# Altium schematic sheet 电源模块.schdoc: AT long bus (13.3 x 4.2 inches)
size A4; Organization: Organization; Address1: Address1; Address2: Address2; Address3: Address3; Address4: Address4; DocumentNumber: 1; Revision: 0; SheetNumber: 2; SheetTotal: 2
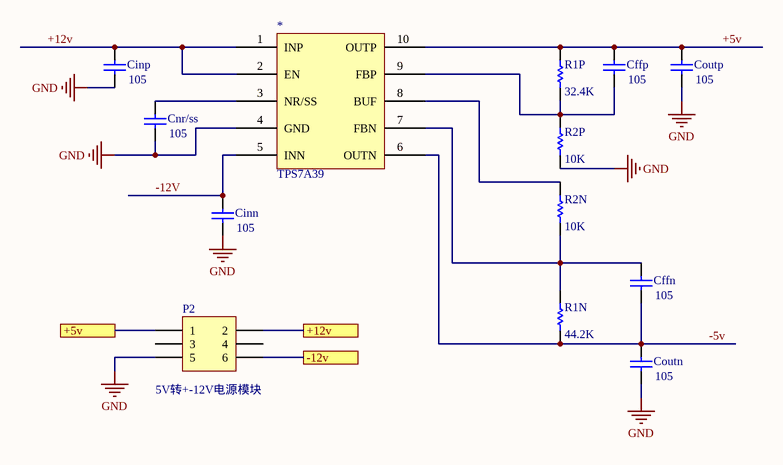
[diagram p0: 电源模块.schdoc]

## Parts
*  TPS7A39
Cffn  value 105  [RAD-0.3]  (hidden comment: Cap)
Cffp  value 105  [RAD-0.3]  (hidden comment: Cap)
Cinn  value 105  [RAD-0.3]  (hidden comment: Cap)
Cinp  value 105  [RAD-0.3]  (hidden comment: Cap)
Cnr/ss  value 105  [RAD-0.3]  (hidden comment: Cap)
Coutn  value 105  [RAD-0.3]  (hidden comment: Cap)
Coutp  value 105  [RAD-0.3]  (hidden comment: Cap)
P2  5V转+-12V电源模块  [HDR2X3]
R1N  value 44.2K  [AXIAL-0.3]  (hidden comment: Res1)
R1P  value 32.4K  [AXIAL-0.3]  (hidden comment: Res1)
R2N  value 10K  [AXIAL-0.3]  (hidden comment: Res1)
R2P  value 10K  [AXIAL-0.3]  (hidden comment: Res1)

## Ports
+5v, +12v, -12v

## Nets
GND: *.4(GND) Cinn.1 Cinp.1 Cnr/ss.1 Coutn.1 Coutp.1 P2.5 R2P.1
+5v: P2.1 ; port +5v
+5v: *.10(OUTP) Cffp.2 Coutp.2 R1P.2  [a separate net that carries the same name]
+12v: P2.2 ; port +12v
+12v: *.1(INP) *.2(EN) Cinp.2  [a separate net that carries the same name]
-5v: *.6(OUTN) Cffn.1 Coutn.2 R1N.1
-12v: P2.6 ; port -12v
-12V: *.5(INN) Cinn.2  [a separate net that carries the same name]
Net*_3: *.3(NR/SS) Cnr/ss.2
Net*_7: *.7(FBN) Cffn.2 R1N.2 R2N.1
Net*_8: *.8(BUF) R2N.2
Net*_9: *.9(FBP) Cffp.1 R1P.1 R2P.2

Not connected (* = marked no-connect by the designer): P2 3 4

## Library data of the parts
Cffn Cffp Cinn Cinp Cnr/ss Coutn Coutp = Cap: Capacitor; Published: 8-Jun-2000; LatestRevisionDate: 17-Jul-2002; LatestRevisionNote: Re-released for DXP Platform.; PackageReference: RAD-0.3; Publisher: Altium Limited; PackageDescription: Radial Cap, Thru-Hole; 2 Leads; 0.3 in Pin Spacing
P2 = Header 3X2: Header, 3-Pin, Dual row; LatestRevisionDate: 17-Jul-2002; LatestRevisionNote: Re-released for DXP Platform.; Publisher: Altium Limited
R1N R1P R2N R2P = Res1: Resistor; Published: 8-Jun-2000; LatestRevisionDate: 17-Jul-2002; LatestRevisionNote: Re-released for DXP Platform.; PackageReference: AXIAL-0.3; Publisher: Altium Limited; PackageDescription: Axial Device, Thru-Hole; 2 Leads; 0.3 in Pin Spacing